# Altium schematic sheet CAN_Transceiver.SchDoc
size 259 x 167 mm; SheetNumber: 5; SheetTotal: 7
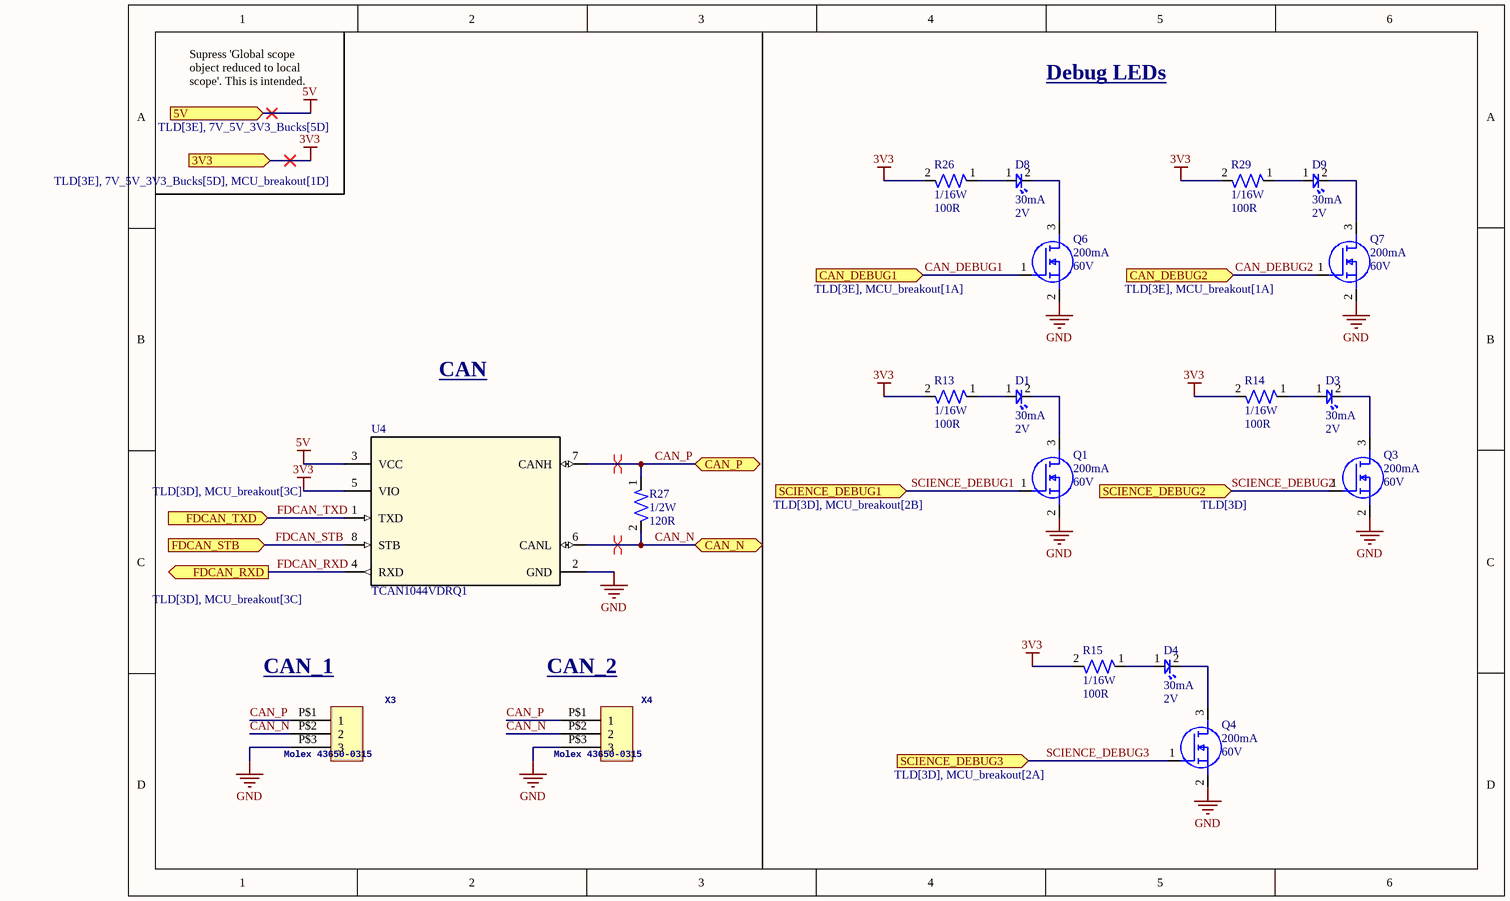
[diagram p0: CAN_Transceiver.SchDoc]

## Parts
D1  Forward Current: 30mA  Forward Voltage: 2V  [LED-0603]  (hidden comment: BL-HKC36G-AV-TRB)
D3  Forward Current: 30mA  Forward Voltage: 2V  [LED-0603]  (hidden comment: BL-HKC36G-AV-TRB)
D4  Forward Current: 30mA  Forward Voltage: 2V  [LED-0603]  (hidden comment: BL-HKC36G-AV-TRB)
D8  Forward Current: 30mA  Forward Voltage: 2V  [LED-0603]  (hidden comment: BL-HKC36G-AV-TRB)
D9  Forward Current: 30mA  Forward Voltage: 2V  [LED-0603]  (hidden comment: BL-HKC36G-AV-TRB)
Q1  Continuous Current: 200mA  Voltage: 60V  [IC-SOT23-3]  (hidden comment: T2N7002AK,LM)
Q3  Continuous Current: 200mA  Voltage: 60V  [IC-SOT23-3]  (hidden comment: T2N7002AK,LM)
Q4  Continuous Current: 200mA  Voltage: 60V  [IC-SOT23-3]  (hidden comment: T2N7002AK,LM)
Q6  Continuous Current: 200mA  Voltage: 60V  [IC-SOT23-3]  (hidden comment: T2N7002AK,LM)
Q7  Continuous Current: 200mA  Voltage: 60V  [IC-SOT23-3]  (hidden comment: T2N7002AK,LM)
R13  Power: 1/16W  Resistance: 100R  [RES-0402]  (hidden comment: RC0402FR-07100RL)
R14  Power: 1/16W  Resistance: 100R  [RES-0402]  (hidden comment: RC0402FR-07100RL)
R15  Power: 1/16W  Resistance: 100R  [RES-0402]  (hidden comment: RC0402FR-07100RL)
R26  Power: 1/16W  Resistance: 100R  [RES-0402]  (hidden comment: RC0402FR-07100RL)
R27  Power: 1/2W  Resistance: 120R  [RES-1210]  (hidden comment: RC1210FR-07120RL)
R29  Power: 1/16W  Resistance: 100R  [RES-0402]  (hidden comment: RC0402FR-07100RL)
U4  TCAN1044VDRQ1  [IC-8SOIC]
X3  Molex 43650-0315  [43650-0315]
X4  Molex 43650-0315  [43650-0315]

## Ports
3V3 (in, see TLD[3E], 7V_5V_3V3_Bucks[5D], MCU_breakout[1D]), 5V (in, see TLD[3E], 7V_5V_3V3_Bucks[5D]), CAN_DEBUG1 (in, see TLD[3E], MCU_breakout[1A]), CAN_DEBUG2 (in, see TLD[3E], MCU_breakout[1A]), CAN_N (bidir), CAN_P (bidir), FDCAN_RXD (out, see TLD[3D], MCU_breakout[3C]), FDCAN_STB (in), FDCAN_TXD (in, see TLD[3D], MCU_breakout[3C]), SCIENCE_DEBUG1 (in, see TLD[3D], MCU_breakout[2B]), SCIENCE_DEBUG2 (in, see TLD[3D]), SCIENCE_DEBUG3 (in, see TLD[3D], MCU_breakout[2A])

## Nets
3V3: R13.2 R14.2 R15.2 R26.2 R29.2 U4.5(VIO) ; port 3V3
5V: U4.3(VCC) ; port 5V
GND: Q1.2(S) Q3.2(S) Q4.2(S) Q6.2(S) Q7.2(S) U4.2(GND) X3.P$3(3) X4.P$3(3)
CAN_DEBUG1: Q6.1(G) ; port CAN_DEBUG1
CAN_DEBUG2: Q7.1(G) ; port CAN_DEBUG2
CAN_N: R27.2 U4.6(CANL) X3.P$2(2) X4.P$2(2) ; port CAN_N
CAN_P: R27.1 U4.7(CANH) X3.P$1(1) X4.P$1(1) ; port CAN_P
FDCAN_RXD: U4.4(RXD) ; port FDCAN_RXD
FDCAN_STB: U4.8(STB) ; port FDCAN_STB
FDCAN_TXD: U4.1(TXD) ; port FDCAN_TXD
SCIENCE_DEBUG1: Q1.1(G) ; port SCIENCE_DEBUG1
SCIENCE_DEBUG2: Q3.1(G) ; port SCIENCE_DEBUG2
SCIENCE_DEBUG3: Q4.1(G) ; port SCIENCE_DEBUG3
NetD1_1: D1.1 R13.1
NetD1_2: D1.2 Q1.3(D)
NetD3_1: D3.1 R14.1
NetD3_2: D3.2 Q3.3(D)
NetD4_1: D4.1 R15.1
NetD4_2: D4.2 Q4.3(D)
NetD8_1: D8.1 R26.1
NetD8_2: D8.2 Q6.3(D)
NetD9_1: D9.1 R29.1
NetD9_2: D9.2 Q7.3(D)

## Layout directives
differential pair: CAN_N, CAN_P

## Notes on the sheet
- Supress 'Global scope object reduced to local scope'. This is intended.
- Debug LEDs
- CAN
- (near X3) CAN_1
- (near X4) CAN_2

## Library data of the parts
D1 D3 D4 D8 D9 = LED-0001: LED YELLOW CLEAR 0603 SMD; ComponentLink1Description: Datasheet; ComponentLink1URL: https://www.americanbrightled.com/pdffiles/led-components/smt/BL-HKC36G-AV-TRB.pdf
Q1 Q3 Q4 Q6 Q7 = NMOS-200MA-0001: MOSFET N-CH 60V 200MA SOT23; ComponentLink1Description: Datasheet; ComponentLink1URL: https://toshiba.semicon-storage.com/info/T2N7002AK_datasheet_en_20150401.pdf?did=29712&prodName=T2N7002AK
R13-R15 R26 R29 = RES-100-0001: RES 100 OHM 1% 1/16W 0402; Tolerance: 1%; Size: 0402; ComponentLink1Description: Datasheet; ComponentLink1URL: https://www.yageo.com/upload/media/product/products/datasheet/rchip/PYu-RC_Group_51_RoHS_L_12.pdf
R27 = RES-120-0001: RES 120 OHM 1% 1/2W 1210; Tolerance: 1%; Size: 1210; ComponentLink1Description: Datasheet; ComponentLink1URL: https://www.yageo.com/upload/media/product/products/datasheet/rchip/PYu-RC_Group_51_RoHS_L_12.pdf
U4 = IC-CAN-0001: IC TRANSCEIVER 1/1 8SOIC; ComponentLink1Description: Datasheet; ComponentLink1URL: https://www.ti.com/lit/ds/symlink/tcan1044-q1.pdf?HQS=dis-dk-null-digikeymode-dsf-pf-null-wwe&ts=1728758303289&ref_url=https%253A%252F%252Fwww.ti.com%252Fgeneral%252Fdocs%252Fsuppproductinfo.tsp%253FdistId%253D10%2526gotoUrl%253Dhttps%253A%252F%252Fwww.ti.com%252Flit%252Fgpn%252Ftcan1044-q1
X3 X4 = Micro-Fit Molex 3 Pin Vertical: GateName_1: G$1; SymbolName_1: HEADER_POS3; DeviceSetName: HEADER_POS3_?; DeviceName: 43650-0315; LibraryName: con-molex-micro-fit-3_0_2; Package: 43650-0315